# EAGLE design design (EAGLE 9.0.0)
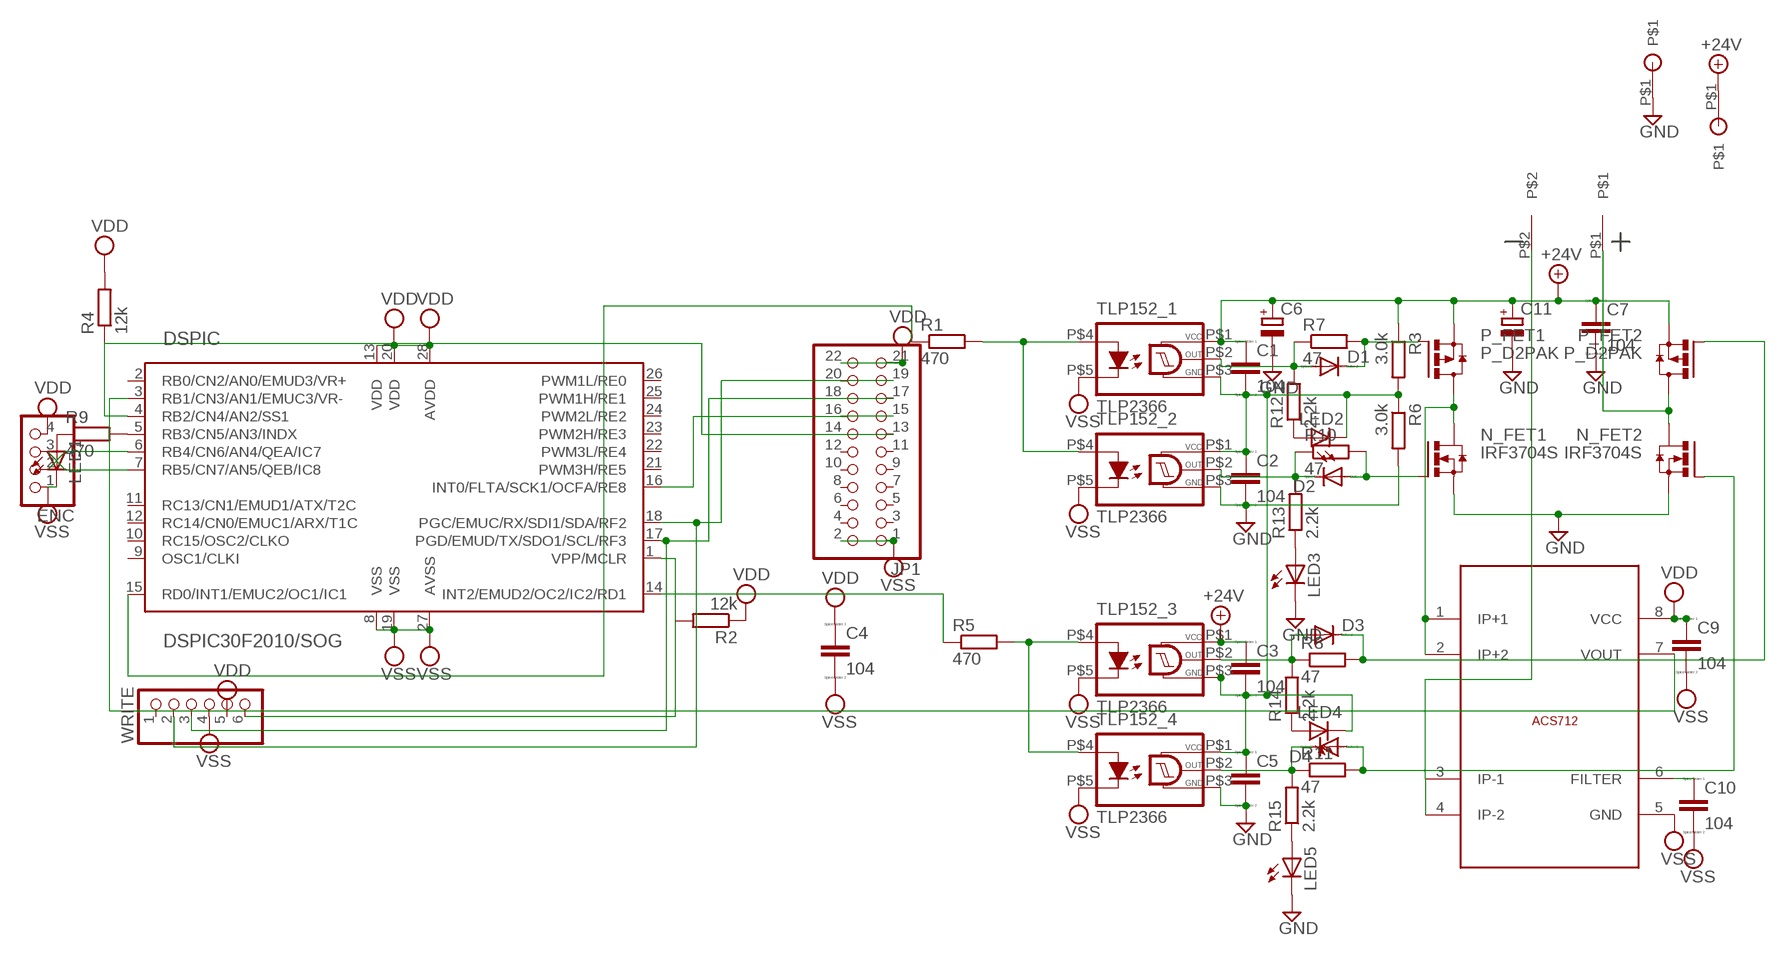
[diagram p0: schematic, sheet 1]

## Parts
ACS712  ACS712ELCTR-30A-T  [SO8]
C1  104  CC2012  [C2012]
C2  104  CC2012  [C2012]
C3  104  CC2012  [C2012]
C4  104  CC2012  [C2012]
C5  CC2012  [C2012]
C6  CPOL-EUTAP5-70  [TAP5-70]
C7  104  CC2012  [C2012]
C9  104  CC2012  [C2012]
C10  104  CC2012  [C2012]
C11  CPOL-EUE5-13  [E5-13]
D1  DIODE-SOD123  [SOD123]
D2  DIODE-SOD123  [SOD123]
D3  DIODE-SOD123  [SOD123]
D4  DIODE-SOD123  [SOD123]
DSPIC  DSPIC30F2010/SOG  [SO-28W]
ENC  PINHD-1X4/90  [1X04/90]
JP1  PINHD-2X11/90  [2X11/90]
LED1  LEDCHIP-LED0603  [CHIP-LED0603]
LED2  LEDCHIP-LED0603  [CHIP-LED0603]
LED3  LEDCHIP-LED0603  [CHIP-LED0603]
LED4  LEDCHIP-LED0603  [CHIP-LED0603]
LED5  LEDCHIP-LED0603  [CHIP-LED0603]
N_FET1  IRF3704S  [D2PACK]
N_FET2  IRF3704S  [D2PACK]
P_FET1  P_D2PAK  [D2PACK]
P_FET2  P_D2PAK  [D2PACK]
R1  470  R-EU_M0805  [M0805]
R2  12k  R-EU_M0805  [M0805]
R3  3.0k  R-EU_M0805  [M0805]
R4  12k  R-EU_M0805  [M0805]
R5  470  R-EU_M0805  [M0805]
R6  3.0k  R-EU_M0805  [M0805]
R7  47  R-EU_M0805  [M0805]
R8  47  R-EU_M0805  [M0805]
R9  470  R-EU_M0805  [M0805]
R10  47  R-EU_M0805  [M0805]
R11  47  R-EU_M0805  [M0805]
R12  2.2k  R-EU_M0805  [M0805]
R13  2.2k  R-EU_M0805  [M0805]
R14  2.2k  R-EU_M0805  [M0805]
R15  2.2k  R-EU_M0805  [M0805]
TLP152_1  TLP2366  [SO6]
TLP152_2  TLP2366  [SO6]
TLP152_3  TLP2366  [SO6]
TLP152_4  TLP2366  [SO6]
U$1  XT60PW  [XT60PW]
U$8  MARU  [MARU]
U$9  MARU  [MARU]
WRITE  PINHD-1X6/90  [1X06/90]

## Nets
+24V: C1.1 C3.1 C6.+ C7.1 C11.+ P_FET1.3(S) P_FET2.3(S) R3.1 TLP152_1.P$1(VCC) TLP152_3.P$1(VCC) U$8.P$1
GND: C2.2 C5.2 C6.- C7.2 C11.- LED3.C LED5.C N_FET1.3(S) N_FET2.3(S) R6.2 TLP152_2.P$3(GND) TLP152_4.P$3(GND) U$9.P$1
N$1: R1.2 TLP152_1.P$4(A) TLP152_2.P$4(A)
N$2: R5.2 TLP152_3.P$4(A) TLP152_4.P$4(A)
N$3: DSPIC.15(RD0/INT1/EMUC2/OC1/IC1) R1.1
N$4: LED1.A R9.1
N$5: D1.A R7.1 R12.2 TLP152_1.P$2(OUT)
N$6: DSPIC.1(VPP/MCLR) R2.2 WRITE.6
N$7: D2.C R10.1 R13.2 TLP152_2.P$2(OUT)
N$8: D2.A N_FET1.1(G) R10.2
N$9: ACS712.1(IP+1) ACS712.2(IP+2) N_FET1.2(D) P_FET1.2(D)
N$10: C1.2 C2.1 C3.2 C5.1 LED2.C LED4.C R3.2 R6.1 TLP152_1.P$3(GND) TLP152_2.P$1(VCC) TLP152_3.P$3(GND) TLP152_4.P$1(VCC)
N$11: DSPIC.6(RB4/CN6/AN4/QEA/IC7) ENC.2
N$12: DSPIC.14(INT2/EMUD2/OC2/IC2/RD1) R5.1
N$16: D1.C P_FET1.1(G) R7.2
N$17: DSPIC.7(RB5/CN7/AN5/QEB/IC8) ENC.3
N$19: DSPIC.4(RB2/CN4/AN2/SS1) JP1.13 JP1.14 R4.1
N$20: LED2.A R12.1
N$21: ACS712.6(FILTER) C10.1
N$22: DSPIC.5(RB3/CN5/AN3/INDX) R9.2
N$23: LED3.A R13.1
N$24: D3.A R8.1 R14.2 TLP152_3.P$2(OUT)
N$25: D4.C R11.1 R15.2 TLP152_4.P$2(OUT)
N$26: DSPIC.16(INT0/FLTA/SCK1/OCFA/RE8) JP1.15 JP1.16
N$27: D4.A N_FET2.1(G) R11.2
N$28: D3.C P_FET2.1(G) R8.2
N$29: ACS712.7(VOUT) DSPIC.3(RB1/CN3/AN1/EMUC3/VR-)
N$30: LED4.A R14.1
N$31: ACS712.3(IP-1) ACS712.4(IP-2) U$1.P$2
N$32: DSPIC.17(PGD/EMUD/TX/SDO1/SCL/RF3) JP1.17 JP1.18 WRITE.3
N$33: LED5.A R15.1
N$34: N_FET2.2(D) P_FET2.2(D) U$1.P$1
N$35: DSPIC.18(PGC/EMUC/RX/SDI1/SDA/RF2) JP1.19 JP1.20 WRITE.2
VDD: ACS712.8(VCC) C4.1 C9.1 DSPIC.13(VDD) DSPIC.20(VDD) DSPIC.28(AVDD) ENC.4 JP1.21 JP1.22 R2.1 R4.2 WRITE.5
VSS: ACS712.5(GND) C4.2 C9.2 C10.2 DSPIC.8(VSS) DSPIC.19(VSS) DSPIC.27(AVSS) ENC.1 JP1.1 JP1.2 LED1.C TLP152_1.P$5(C) TLP152_2.P$5(C) TLP152_3.P$5(C) TLP152_4.P$5(C) WRITE.4
Unconnected: DSPIC.2(RB0/CN2/AN0/EMUD3/VR+) DSPIC.9(OSC1/CLKI) DSPIC.10(RC15/OSC2/CLKO) DSPIC.11(RC13/CN1/EMUD1/ATX/T2C) DSPIC.12(RC14/CN0/EMUC1/ARX/T1C) DSPIC.21(PWM3H/RE5) DSPIC.22(PWM3L/RE4) DSPIC.23(PWM2H/RE3) DSPIC.24(PWM2L/RE2) DSPIC.25(PWM1H/RE1) DSPIC.26(PWM1L/RE0) JP1.3 JP1.4 JP1.5 JP1.6 JP1.7 JP1.8 JP1.9 JP1.10 JP1.11 JP1.12 WRITE.1

## Library data of the parts
ACS712 = arita:ACS712ELCTR-30A-T
C1-C5 C7 C9 C10 = eagle-ltspice:C: CAPACITOR, European symbol; SPICEMODEL: NONE; SPICEPREFIX: C
C6 C11 = resistor:CPOL-EU: POLARIZED CAPACITOR, European symbol
D1-D4 = diode:DIODE-: DIODE
DSPIC = microchip-dspic:DSPIC30F2010: dsPIC Motion Controller DSC
ENC = pinhead:PINHD-1X4: PIN HEADER
JP1 = pinhead:PINHD-2X11: PIN HEADER
LED1-LED5 = led:LED: LED OSRAM: - CHIPLED LG R971, LG N971, LY N971, LG Q971, LY Q971, LO R971, LY R971 LH N974, LH R974 LS Q976, LO Q976, LY Q976 LO Q996 - Hyper CHIPLED LW Q18S LB Q993, LB Q99A, LB R99A - SideLED LS A670, LO A670, LY A670, LG A670, LP A670 LB A673, LV A673, LT A673, LW A673 LH A674 LY A675 LS A676, LA A676, LO A676, LY A676, LW A676 LS A679, LY A679, LG A679 - Hyper Micro SIDELED® LS Y876, LA Y876, LO Y876, LY Y876 LT Y87S - SmartLED LW L88C, LW L88S LB L89C, LB L89S, LG L890 LS L89K, LO L89K, LY L89K LS L896, LA L896, LO L896, LY L896 - TOPLED LS T670, LO T670, LY T670, LG T670, LP T670 LSG T670, LSP T670, LSY T670, LOP T670, LYG T670 LG T671, LOG T671, LSG T671 LB T673, LV T673, LT T673, LW T673 LH T674 LS T676, LA T676, LO T676, LY T676, LB T676, LH T676, LSB T676, LW T676 LB T67C, LV T67C, LT T67C, LS T67K, LO T67K, LY T67K, LW E67C LS E67B, LA E67B, LO E67B, LY E67B, LB E67C, LV E67C, LT E67C LW T67C LS T679, LY T679, LG T679 LS T770, LO T770, LY T770, LG T770, LP T770 LB T773, LV T773, LT T773, LW T773 LH T774 LS E675, LA E675, LY E675, LS T675 LS T776, LA T776, LO T776, LY T776, LB T776 LHGB T686 LT T68C, LB T68C - Hyper Mini TOPLED® LB M676 - Mini TOPLED Santana® LG M470 LS M47K, LO M47K, LY M47K Source: http://www.osram.convergy.de LUXEON: - LUMILED® LXK2-PW12-R00, LXK2-PW12-S00, LXK2-PW14-U00, LXK2-PW14-V00 LXK2-PM12-R00, LXK2-PM12-S00, LXK2-PM14-U00 LXK2-PE12-Q00, LXK2-PE12-R00, LXK2-PE12-S00, LXK2-PE14-T00, LXK2-PE14-U00 LXK2-PB12-K00, LXK2-PB12-L00, LXK2-PB12-M00, LXK2-PB14-N00, LXK2-PB14-P00, LXK2-PB14-Q00 LXK2-PR12-L00, LXK2-PR12-M00, LXK2-PR14-Q00, LXK2-PR14-R00 LXK2-PD12-Q00, LXK2-PD12-R00, LXK2-PD12-S00 LXK2-PH12-R00, LXK2-PH12-S00 LXK2-PL12-P00, LXK2-PL12-Q00, LXK2-PL12-R00 Source: www.luxeon.com KINGBRIGHT: KA-3528ASYC Source: www.kingbright.com
N_FET1 N_FET2 = transistor-power:IRF3704: SMPS MOSFET HEXFET® Power MOSFET Source: http://www.irf.com/product-info/datasheets/data/irf3704.pdf
P_FET1 P_FET2 = transistor-power:P_D2PAK
R1-R15 = resistor:R-EU_: RESISTOR, European symbol
TLP152_1-TLP152_4 = toshiba:TLP2366
U$1 = con_XT:XT60PW
U$8 U$9 = abouters_hira:MARU
WRITE = pinhead:PINHD-1X6: PIN HEADER

## Net classes
0 default: clearance 0.35 mm

## Board
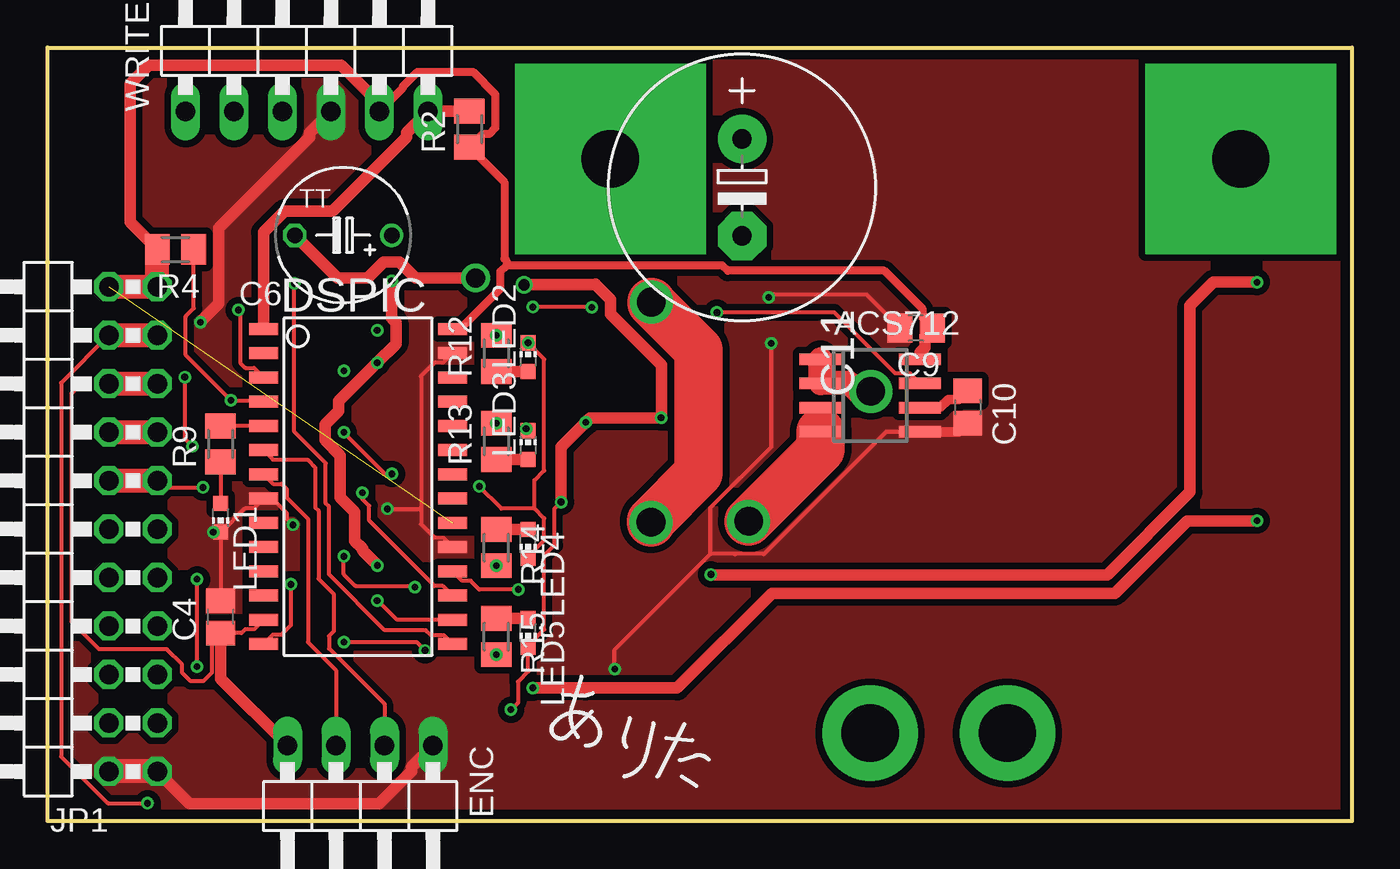
[diagram p1: board, top side]
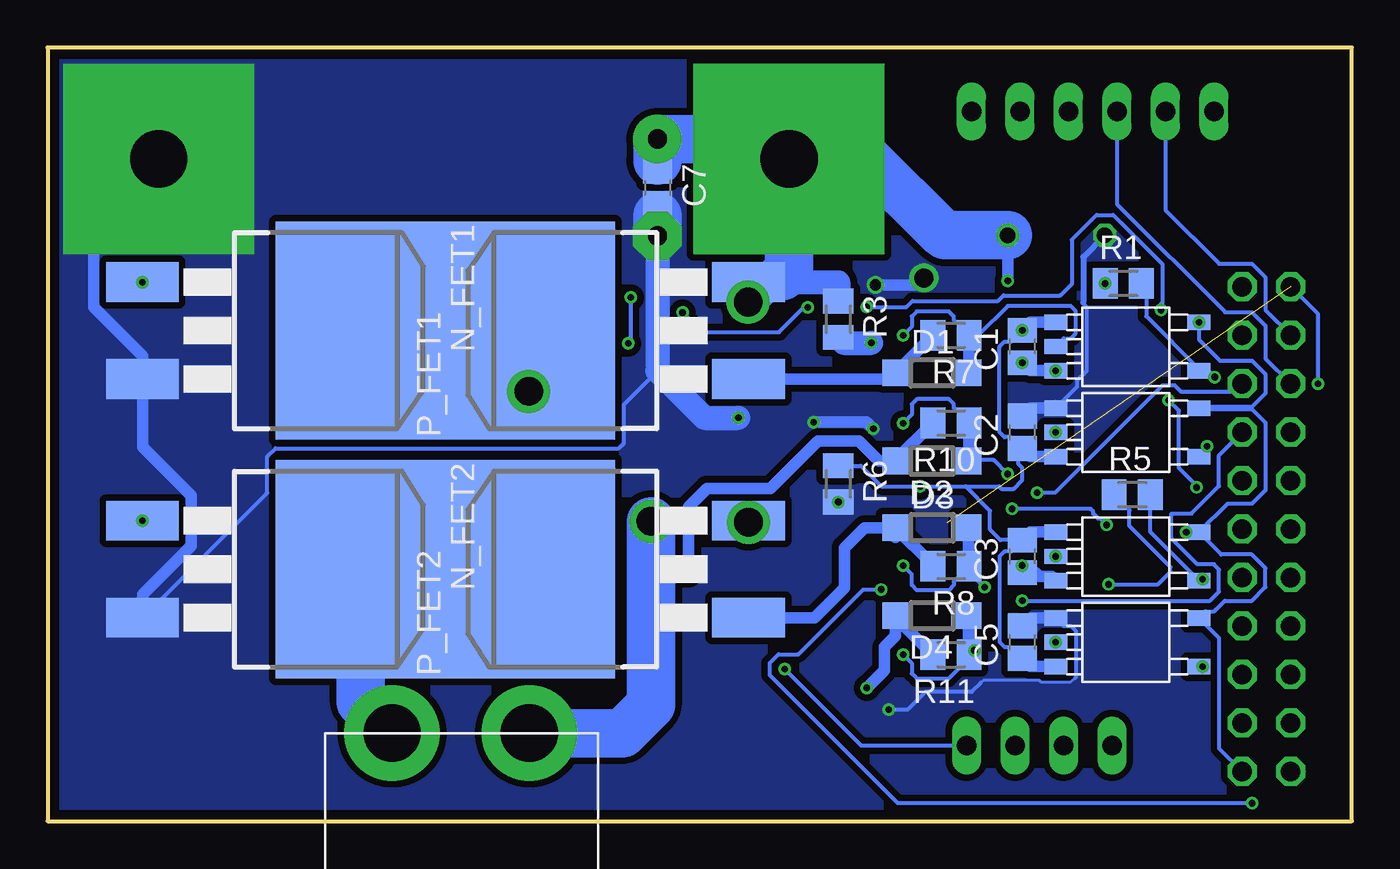
[diagram p2: board, bottom side, seen from below]

Size 68.33 x 40.53 mm. Coordinates in mm from the lower left corner, seen from the top.
Outline: 0,40.53 68.33,40.53 68.33,0 0,0 0,40.53
Copper layers (1*16): Top 0.035mm / dielectric 1.6mm / Bottom 0.035mm
Design rules "Elecrow_2-layer_PCB_eagle_rule": minimum track width 6mil, minimum drill 12mil, track to track 6mil, track to pad 6mil, pad to pad 6mil, via to via 8mil, smd to smd 0mil, copper to edge 20mil, drill to drill 10mil, minimum pad ring 6mil, minimum via ring 6mil, stop-mask expansion 0mil, vias tented up to drill 100mil, thermal gap 10mil

### Footprints (pad centres in the part's own frame; a part is rotated, then mirrored left to right if it is on the bottom)
SO8 = smd 0.6 x 2.2: 1 -1.905,-2.6; 2 -0.635,-2.6; 3 0.635,-2.6; 4 1.905,-2.6; 5 1.905,2.6; 6 0.635,2.6; 7 -0.635,2.6; 8 -1.905,2.6
C2012 = smd 1.3 x 1.5: 1 -0.85,0; 2 0.85,0
TAP5-70 = drill 0.813: + -2.54,0 | drill 0.813 octagon: - 2.54,0
E5-13 = drill 1.016 pad 2.54: + -2.54,0 | drill 1.016 pad 2.54 octagon: - 2.54,0
SOD123 = smd 1.4 x 1.4: A 1.9,0; C -1.9,0
SO-28W = smd 0.635 x 1.524: 1 -7.62,-4.953; 2 -6.35,-4.953; 3 -5.08,-4.953; 4 -3.81,-4.953; 5 -2.54,-4.953; 6 -1.27,-4.953; 7 0,-4.953; 8 1.27,-4.953; 9 2.54,-4.953; 10 3.81,-4.953; 11 5.08,-4.953; 12 6.35,-4.953; 13 7.62,-4.953; 14 8.89,-4.953; 15 8.89,4.953; 16 7.62,4.953; 17 6.35,4.953; 18 5.08,4.953; 19 3.81,4.953; 20 2.54,4.953; 21 1.27,4.953; 22 0,4.953; 23 -1.27,4.953; 24 -2.54,4.953; 25 -3.81,4.953; 26 -5.08,4.953; 27 -6.35,4.953; 28 -7.62,4.953
1X04/90 = drill 1.016 long: 1 -3.81,-3.81; 2 -1.27,-3.81; 3 1.27,-3.81; 4 3.81,-3.81
2X11/90 = drill 1.016 octagon: 1 -12.7,-6.35; 2 -12.7,-3.81; 3 -10.16,-6.35; 4 -10.16,-3.81; 5 -7.62,-6.35; 6 -7.62,-3.81; 7 -5.08,-6.35; 8 -5.08,-3.81; 9 -2.54,-6.35; 10 -2.54,-3.81; 11 0,-6.35; 12 0,-3.81; 13 2.54,-6.35; 14 2.54,-3.81; 15 5.08,-6.35; 16 5.08,-3.81; 17 7.62,-6.35; 18 7.62,-3.81; 19 10.16,-6.35; 20 10.16,-3.81; 21 12.7,-6.35; 22 12.7,-3.81
CHIP-LED0603 = smd 0.8 x 0.8: A 0,-0.75; C 0,0.75
D2PACK = smd 2.083 x 3.81: 1 -2.54,-8.89; 3 2.54,-8.89 | smd 11.43 x 8.89: 2 0,2.54
M0805 = smd 1.3 x 1.6: 1 -0.95,0; 2 0.95,0
SO6 = smd 0.8 x 1.2: P$1 -1.27,3.75; P$2 0,3.75; P$3 1.27,3.75; P$4 -1.27,-3.75; P$5 1.27,-3.75
XT60PW = drill 3 pad 5: P$1 0,0; P$2 7.2,0
MARU = drill 3 pad 10 square: P$1 0,0
1X06/90 = drill 1.016 long: 1 -6.35,-3.81; 2 -3.81,-3.81; 3 -1.27,-3.81; 4 1.27,-3.81; 5 3.81,-3.81; 6 6.35,-3.81

### Placement (x,y rotation side)
ACS712  43.1,22.3 270 top
C1  17.26,24.87 90 bottom
C2  17.26,20.37 90 bottom
C3  17.26,13.87 90 bottom
C4  9.06,10.7 90 top
C5  17.26,9.37 90 bottom
C6  15.48,30.7 180 top
C7  36.38,33.2 270 bottom
C9  45.5,25.84 180 top
C10  48.2,21.7 270 top
C11  36.38,33.2 270 top
D1  22,23.49 0 bottom
D2  22,18.87 180 bottom
D3  22,15.37 0 bottom
D4  22,10.76 180 bottom
DSPIC  16.26,18.17 270 top
ENC  16.37,0.15 180 top
JP1  -0.61,15.3 90 top
LED1  9.06,15.9 180 top
LED2  25.17,24.31 0 top
LED3  25.17,19.7 0 top
LED4  25.17,14.53 180 top
LED5  25.17,9.87 180 top
N_FET1  54.47,25.7 270 bottom
N_FET2  54.47,13.2 270 bottom
P_FET1  40.5,25.7 90 bottom
P_FET2  40.5,13.2 90 bottom
R1  11.97,28.17 0 bottom
R2  22.1,36.26 90 top
R3  26.9,26.3 270 bottom
R4  6.7,29.95 180 top
R5  11.5,17.1 0 bottom
R6  26.9,17.67 270 bottom
R7  21,25.46 180 bottom
R8  21,13.35 180 bottom
R9  9.06,19.76 90 top
R10  21,20.86 180 bottom
R11  21,8.72 180 bottom
R12  23.5,24.51 90 top
R13  23.5,19.9 90 top
R14  23.5,14.33 270 top
R15  23.5,9.67 270 top
TLP152_1  11.76,24.87 90 bottom
TLP152_2  11.76,20.37 90 bottom
TLP152_3  11.76,13.87 90 bottom
TLP152_4  11.76,9.37 90 bottom
U$1  50.29,4.61 180 top
U$8  29.48,34.7 0 top
U$9  62.52,34.7 0 top
WRITE  13.57,41 0 top

### Tracks (layer width: path | path; a pad name or v marks a point on that pad's centre or on a via)
+24V  (via drill 0.35, 1.5)
  Top 0.61: v18.02,28.32 18.02,26.35 18.24,26.13 18.24,25 C1.1 15.25,22.01 15.25,21.5 14.53,20.78 14.53,19.96 15.33,19.16 15.33,16.96 16.09,16.21 16.09,14.68 16.49,14.28 16.49,14.18 v17.28,13.39
  Top 2.54: v31.63,27.2 31.63,27.15 34.1,24.68 34.1,18.23 P_FET2.3 v31.61,15.66
  Bottom 0.2: R3.1 26.9,26.94 | C7.1 C11.+
  Bottom 0.61: TLP152_1.P$1 16.84,23.6 C1.1 | R3.1 27.17,26.98 | C6.+ v18.02,28.32 | v17.28,13.39 17.26,13.37 C3.1 16.59,13.02 16.38,12.82 15.72,12.82 TLP152_3.P$1
  Bottom 1.27: 29.48,28.28 29.52,28.24 | R3.1 26.9,28.24 29.52,28.24 | P_FET2.3 v31.61,15.66 | 29.52,28.24 P_FET1.3 31.63,28.22 v31.63,27.2 31.19,27.2 29.48,28.9
  Bottom 2.54: U$8.P$1 30.52,35.74 C11.+ 36.38,34.62 | U$8.P$1 29.48,28.9 29.83,28.55 | U$8.P$1 25.37,34.7 21.5,30.83 21.44,30.83 21.31,30.7 C6.+
  other vias: 17.26,24.02 15.51,23.6
GND  (via drill 0.35, 0.6, 1)
  Top 0.2: LED3.C 25.17,20.5 | v24.27,5.84 24.64,6.2 24.64,7.3 25.17,7.83 LED5.C 25.17,9.18 26.02,10.03 26.02,13.92 26.57,14.47 26.57,16.39 R6.2
  Top 0.61: v25.07,20.55 LED3.C | 28.71,28.11 28.71,28.13 | 28.71,28.11 29.49,27.33 29.49,26.57 32.16,23.9 32.16,21.15 v32.14,21.13 28.43,21.13 v28.2,20.91 26.9,19.61 R6.2 | 28.71,28.11 24.98,28.11 v24.96,28.1 | C6.- 15.18,28.46 16.77,28.46 17.61,29.3 18.43,29.3 19.27,28.46 v22.42,28.46
  Bottom 0.152: 14.46,7.51 14.49,7.51 14.73,7.27 16.29,7.27 16.38,7.37 19.31,7.37 19.43,7.25
  Bottom 0.2: TLP152_4.P$3 15.09,10.22 14.72,10.22 14.46,9.96 14.46,7.51 | v24.27,5.84 23.28,5.84 22.35,6.76 19.92,6.76 19.43,7.25 | 15.51,21.96 TLP152_2.P$3 14.4,22.75 14.4,23.08 13.91,23.56 13.91,26.95 14.07,27.12 14.07,27.19 | 36.38,23.59 38.14,21.83 38.14,19.8 38.41,19.54 56.39,19.54 56.83,19.1 56.83,17.2 N_FET2.3 | C11.- C7.2
  Bottom 0.305: C6.- 14.07,29.57 14.07,27.19
  Bottom 0.61: TLP152_2.P$3 16.84,21.64 C2.2 | N_FET2.3 63.36,11.87 60.8,14.43 60.8,17.05 63.36,19.61 N_FET1.3 63.36,24.37 65.92,26.93 65.92,31.3 U$9.P$1 | v28.2,20.91 25.42,20.91 v25.07,20.55 | v24.96,28.1 22.78,28.1 v22.42,28.46 | C5.2 16.91,10.57 16.85,10.57 16.78,10.64 TLP152_4.P$3
  Bottom 1.27: C11.- 36.38,23.59 33.92,21.13 v32.14,21.13
  Bottom 2.54: C11.- 36.38,31.73
  other vias: 26.9,16.72
  pour Bottom (no thermals): -0.83,41.47 -0.83,-0.58 69.42,-0.58 69.42,41.47
N$1  (via drill 0.35)
  Top 0.2: v7.18,23.27 7.18,20.04 v7.58,19.64
  Bottom 0.2: v7.18,23.27 7.51,23.6 TLP152_1.P$4 8.01,23.69 10.78,26.46 10.78,27.93 R1.2 | v7.58,19.64 8.01,19.21 TLP152_2.P$4
N$2  (via drill 0.35)
  Top 0.2: v7.82,8.1 v7.82,12.67
  Bottom 0.2: R5.2 10.55,15.14 TLP152_3.P$4 7.9,12.6 v7.82,12.67 | TLP152_4.P$4 v7.82,8.1
N$3  (via drill 0.35)
  Top 0.2: DSPIC.15 20.78,9.72 20.1,9.72 19.81,10 17.66,10 14.73,12.93 14.73,16.49 14.57,16.65 14.57,18.76 12.92,20.41 R1.1
  Bottom 0.2: R1.1 13.36,27.73
  other vias: 12.92,28.17
N$4
  Top 0.2: R9.1 LED1.A
N$5  (via drill 0.35)
  Bottom 0.2: TLP152_1.P$2 15.09,25.29 14.72,25.29 14.46,25.55 14.46,26.73 14.72,26.99 18.03,26.99 19.56,25.46 R7.1 20.85,26.26 20.85,26.45 21.11,26.71 22.79,26.71 23.05,26.45 23.05,25.91 R12.2
  Bottom 0.61: R7.1 20.05,23.54 D1.A
  other vias: 23.5,25.46
N$6
  Top 0.152: 11.51,25.99 DSPIC.1
  Top 0.61: R2.2 22.08,37.19 WRITE.6 18.8,36.07 18.8,35.84 14.92,31.96 12.42,31.96 11.31,30.86 DSPIC.1
N$7  (via drill 0.35)
  Top 0.2: TLP152_2.P$2 17.69,18.19 v18.04,18.19
  Bottom 0.2: R10.1 20.85,21.66 20.85,21.85 21.11,22.11 22.79,22.11 23.05,21.85 23.05,21.3 R13.2 | v18.04,18.19 18.77,18.92 20.05,18.92
  Bottom 0.61: R10.1 20.05,18.92 D2.C
  other vias: 23.5,20.85 15.51,20.37
N$8  (via drill 0.35)
  Top 0.61: v34.75,12.92 34.75,12.9 55.51,12.9 59.85,17.24 59.85,27.02 61.07,28.24 N_FET1.1
  Bottom 0.61: R10.2 23.9,18.91 D2.A 24.77,18.87 25.83,19.93 27.97,19.93 30.46,17.44 33.79,17.44 34.75,16.47 v34.75,12.92
  other vias: 63.36,28.24
N$9  (via drill 1.5)
  Top 0.2: ACS712.2
  Top 1.27: v43.12,22.52 42.44,22.52 42.01,22.95 ACS712.2 ACS712.1
  Bottom 0.2: 40.48,23.45 41.12,22.8 41.12,22.31 | v43.12,22.52 42.86,22.52 41.83,23.55
  Bottom 0.61: 41.12,22.31 41.83,23.55 P_FET1.2 N_FET1.2
N$10  (via drill 0.35)
  Top 0.2: v22.62,17.54 23.77,16.38 25.51,16.38 | LED4.C 25.17,13.84 26.02,14.69 26.02,15.87 25.51,16.38 | 25.51,16.38 25.51,17.85 26.02,18.36 26.02,24.21 LED2.C
  Bottom 0.2: C1.2 17.86,25.12 18.2,25.12 18.46,24.86 18.46,20.38 18.2,20.12 17.86,20.12 C2.1 17.46,19.52 17.46,18.71 17.26,18.52 17.26,17.87 17.71,17.41 18.36,17.41 18.48,17.54 20.23,17.54 | 15.59,19.1 TLP152_2.P$1 | R6.1 25.72,18.62 24.63,17.54 v22.62,17.54 20.23,17.54 | C5.1 17.86,9.12 18.2,9.12 18.46,9.38 18.46,13.86 18.2,14.12 17.86,14.12 C3.2 18.4,14.72 18.95,15.27 18.95,16.26 20.23,17.54
  Bottom 0.61: TLP152_1.P$3 16.84,26.14 C1.2 | TLP152_2.P$1 16.84,19.1 C2.1 | TLP152_3.P$3 16.84,15.14 C3.2 | TLP152_4.P$1 16.84,8.1 C5.1
  Bottom 1.27: R3.2 26.61,25.06 LED2.C
  other vias: 17.26,25.72 25.17,25.06
N$11
  Top 0.2: DSPIC.6 11.81,18.94 13.61,18.94 14.02,18.53 14.02,16.43 14.18,16.27 14.18,12.7 14.98,11.9 14.98,9.94 14.73,9.69 14.73,9.05 17.64,6.14 ENC.2
N$12  (via drill 0.35)
  Top 0.2: DSPIC.14 11.81,9.78 12.25,9.78 12.75,10.27 v12.75,12.41
  Bottom 0.2: v12.75,12.41 10.15,12.41 9.5,13.06 9.5,13.31 11.65,15.46 11.65,16.3 R5.1
N$16
  Bottom 0.2: 21.95,25.44 R7.2
  Bottom 0.61: 21.95,25.44 D1.C 24.24,23.15 29.36,23.15 | 30.57,23.15 29.36,23.15 | P_FET1.1 29.37,23.16 29.36,23.15
N$17
  Top 0.2: DSPIC.7 11.81,17.67 12.25,17.67 12.52,17.4 12.52,16.96 13.63,15.84 13.63,9.37 15.1,7.9 ENC.3
N$19  (via drill 0.35)
  Top 0.2: JP1.13 6.1,17.48 v8.14,17.48 | DSPIC.4 11.24,22.05 v9.6,22.05 7.23,24.42 7.23,26.46 7.65,26.88 R4.1
  Top 1.27: JP1.14 JP1.13
  Bottom 0.2: v9.6,22.05 9.06,21.51 9.06,18.51 8.14,17.59 v8.14,17.48
N$20
  Top 0.61: LED2.A R12.1
N$21
  Top 0.508: C10.1 47.75,22.1 47.2,22.1 46.76,21.66 ACS712.6
N$22
  Top 0.2: DSPIC.5 R9.2
N$23
  Top 0.61: LED3.A R13.1
N$24  (via drill 0.35)
  Top 0.2: TLP152_3.P$2 15.51,12.93 16.12,12.32 19.16,12.32 v19.24,12.25
  Bottom 0.2: R8.1 20.85,12.55 20.85,12.36 21.11,12.1 22.79,12.1 23.05,12.36 23.05,12.93 R14.2 | R8.1 20.05,14.04 | v19.24,12.25 20.05,13.06 R8.1
  Bottom 0.61: R8.1 20.1,13.4 D3.A
  other vias: 23.5,13.38 15.51,13.87
N$25  (via drill 0.35)
  Top 0.2: v19.77,8.94 19.34,9.37 TLP152_4.P$2
  Bottom 0.2: 19.99,8.72 R11.1 | 19.99,8.72 v19.77,8.94 | R15.2 23.05,8.27 23.05,7.73 22.79,7.47 21.11,7.47 19.99,8.59 19.99,8.72
  Bottom 0.61: D4.C 20.1,8.77 R11.1
  other vias: 23.5,8.72 15.51,9.37
N$26  (via drill 0.35)
  Top 0.2: DSPIC.16 18.32,10.55 17.32,11.55 v17.26,11.55
  Top 1.27: JP1.16 JP1.15
  Bottom 0.2: JP1.15 6.96,19.16 6.96,17.56 8.4,16.11 9.45,16.11 9.45,14.82 8.08,13.45 7.22,13.45 6.96,13.19 6.96,12.01 7.43,11.55 v17.26,11.55
N$27  (via drill 0.35)
  Top 0.2: 28.2,7.02 28.16,6.98
  Top 0.61: N_FET2.1 59.71,15.74 55.91,11.94 37.95,11.94 32.99,6.98 28.16,6.98 v25.41,6.98
  Bottom 0.61: R11.2 23.9,10.67 D4.A 23.9,9.71 24.48,9.13 24.48,7.91 v25.41,6.98
  other vias: 63.36,15.74
N$28
  Bottom 0.61: R8.2 21.95,13.42 D3.C | D3.C 23.9,14.87 | P_FET2.1 28.14,10.66 26.59,12.22 26.59,14.32 25.53,15.37 D3.C
N$29  (via drill 0.35)
  Top 0.2: ACS712.7 45.18,23.45 44.41,23.45 41.22,26.65 v35.07,26.65 | v10,26.78 10.09,26.69 10.09,24.02 10.36,23.75 10.8,23.75 DSPIC.3 | v25.42,26.94 25.43,26.93 v28.51,26.93
  Bottom 0.2: v10,26.78 10,27.1 9.92,27.18 9.92,29.18 12.5,31.76 13.38,31.76 14.68,30.46 14.68,28.13 15.27,27.54 18.25,27.54 18.53,27.26 23.01,27.26 23.33,26.94 v25.42,26.94 | v35.07,26.65 34.04,25.62 30.01,25.62 28.7,26.93 v28.51,26.93
N$30
  Top 0.61: LED4.A R14.1
N$31  (via drill 1.5)
  Top 0.2: ACS712.3 ACS712.4 40.5,20.99
  Top 2.54: ACS712.4 40.5,19.48 v36.73,15.71
  Bottom 2.54: v36.73,15.71 36.73,6.1 38.22,4.61 U$1.P$2
N$32  (via drill 0.35)
  Top 0.2: DSPIC.17 20.71,12.32 20.27,12.32 16.84,15.74 16.84,16.52 16.48,16.88 v16.48,17.2
  Top 1.27: JP1.18 JP1.17
  Bottom 0.2: JP1.17 6.17,22.49 8.94,22.49 9.28,22.83 9.92,22.83 15.55,17.2 v16.48,17.2 | WRITE.3 12.3,32.34 6.64,26.67 5.24,26.67 4.53,25.96 4.53,24.25 JP1.18
N$33
  Top 0.61: R15.1 LED5.A
N$34
  Bottom 0.61: N_FET2.2 P_FET2.2
  Bottom 2.54: 43.04,9.8 P_FET2.2 | N_FET2.2 51.93,6.25 U$1.P$1
N$35  (via drill 0.35)
  Top 0.2: v5.23,0.94 3.15,0.94 0.71,3.38 0.71,22.97 JP1.20 | DSPIC.18 21.72,12.59 22.16,12.59 22.61,12.14 v24.66,12.14
  Top 1.27: JP1.20 JP1.19
  Bottom 0.2: WRITE.2 9.76,32.02 6.95,29.21 5.24,29.21 4.53,28.5 4.53,26.79 JP1.20 | v5.23,0.94 23.79,0.94 30.49,7.64 30.49,8.28 30.03,8.74 29,8.74 25.6,12.14 v24.66,12.14
VDD  (via drill 0.35)  (1 unrouted)
  Top 0.2: JP1.22 3.2,27.81 | 46.35,26.39 C9.1 | DSPIC.13 10.8,10.05 10.36,10.05 10.16,9.85 C4.1 8.6,9.39 8.6,7.78 8.14,7.32 7.5,7.32 7.05,7.78 7.05,8.21 6.24,9.01 2.7,9.01 1.26,10.45 1.26,22.42 v1.76,22.92 | DSPIC.28 21.74,25.79
  Top 0.406: C9.1 45.85,26.34 45.85,26.82 43.84,28.84 35.62,28.84 35.34,29.12 24.03,29.12 | DSPIC.28 21.6,25.79 23.72,27.92 23.72,28.81 24.03,29.12 | WRITE.5 18.61,38.42 18.61,38.5 19.38,39.27 22.27,39.27 23.45,38.09 23.45,36.33 23.13,36.01 22.8,36.01 R2.1 23.93,33.48 23.93,29.47 24.03,29.37 24.03,29.12
  Top 0.61: ACS712.8 45.7,24.56 45.95,24.82 45.95,25.45 C9.1 | R4.2 4.32,31.38 4.32,38.65 5.29,39.62 15.37,39.62 17.38,37.61 WRITE.5 | C4.1 9.06,7.46 ENC.4
  Top 1.27: JP1.22 JP1.21 R4.2
  Bottom 0.2: v1.76,22.92 1.76,26.56 JP1.22
VSS  (via drill 0.35)
  Top 0.2: 9.11,15.15 LED1.C C4.2 | 9.11,15.15 10.36,16.4 10.8,16.4 DSPIC.8 11.75,16.9 12.52,16.13 12.52,15.86 v12.86,15.52 | 46.59,20.39 ACS712.5 43.92,20.39 37.52,13.99 36.02,13.99 36.01,14 34.73,14 | C9.2 42.88,27.61 37.79,27.61 37.79,27.46 v37.77,27.44 | v8.67,15.14 9.1,15.14 9.11,15.15 | v29.71,7.96 29.71,8.98 34.73,14 | 34.73,14 34.73,16.42 37.92,19.61 v37.92,25.03 | DSPIC.27 20.71,24.02 20.27,24.02 19.56,23.31 19.56,16.31 | DSPIC.19 20.71,14.86 20.27,14.86 19.56,15.57 19.56,16.31 | v17.8,16.36 19.51,16.36 19.56,16.31
  Top 0.508: ACS712.5 47.75,20.39 C10.2
  Top 0.61: JP1.1 7.43,0.91 17.36,0.91 19.06,2.61 19.06,2.84 ENC.1 | WRITE.4 13.72,36.07 13.72,35.84 8.95,31.08 8.95,27.12 8.01,26.17 TLP152_1.P$5
  Top 1.27: JP1.1 JP1.2
  Bottom 0.152: 2.49,2.6 JP1.2
  Bottom 0.2: v37.92,25.03 37.77,25.17 v37.77,27.44 | TLP152_1.P$5 8.01,25.24 6.91,24.13 5.24,24.13 4.53,23.42 4.53,22.42 5.24,21.71 7.94,21.71 TLP152_2.P$5 7.96,21.59 5.24,21.59 4.53,20.88 4.53,17.34 5.24,16.63 6.52,16.63 TLP152_3.P$5 | TLP152_3.P$5 6.84,13.97 5.24,13.97 4.53,13.26 4.53,12.26 5.24,11.55 6.65,11.55 6.97,11.23 7.13,11.07 7.2,11 7.65,11 TLP152_4.P$5 6.96,9.59 6.96,3.82 JP1.1 | TLP152_3.P$5 v8.67,15.14 | v29.71,7.96 25.71,3.96 ENC.1 | v17.8,16.36 13.69,16.36 13.55,16.22 13.55,16.11 13.29,15.85 13.18,15.85 v12.86,15.52
  other vias: 8.01,26.14
  pour Top (no thermals): -0.52,40.88 -0.52,0.12 68.76,0.79 68.76,41.55